# Altium project Controller.PrjPcb
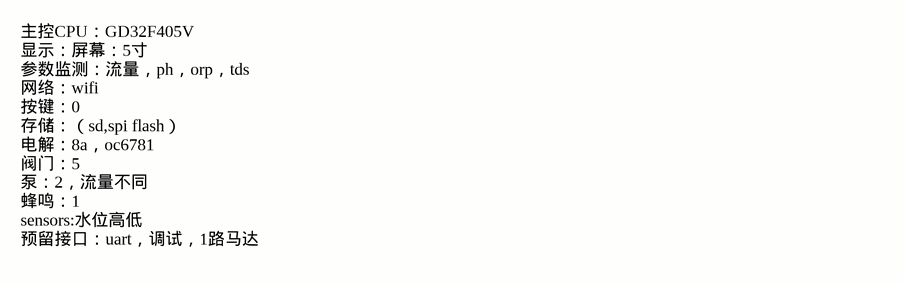
[diagram p0: top.SchDoc]
7 sheets, 134 parts. Net scope: global (net labels, ports and power ports of the same name join across sheets).
Board file: 电解模块主控板_V1.0_ZM_20210726.PcbDoc
Sheets:
  top.SchDoc
  cpu.SchDoc
  04_Sensor.SchDoc
  02_Power.SchDoc
  com.SchDoc
  15_LCD.SchDoc
  07_EL_CON.SchDoc

## Sheet top.SchDoc
size A4

### Notes on the sheet
- 主控CPU：GD32F405V
  显示：屏幕：5寸
  参数监测：流量，ph，orp，tds
  网络：wifi
  按键：0
  存储：（sd,spi flash）
  电解：8a，oc6781
  阀门：5
  泵：2，流量不同
  蜂鸣：1
  sensors:水位高低
  预留接口：uart，调试，1路马达

## Sheet cpu.SchDoc
size A2
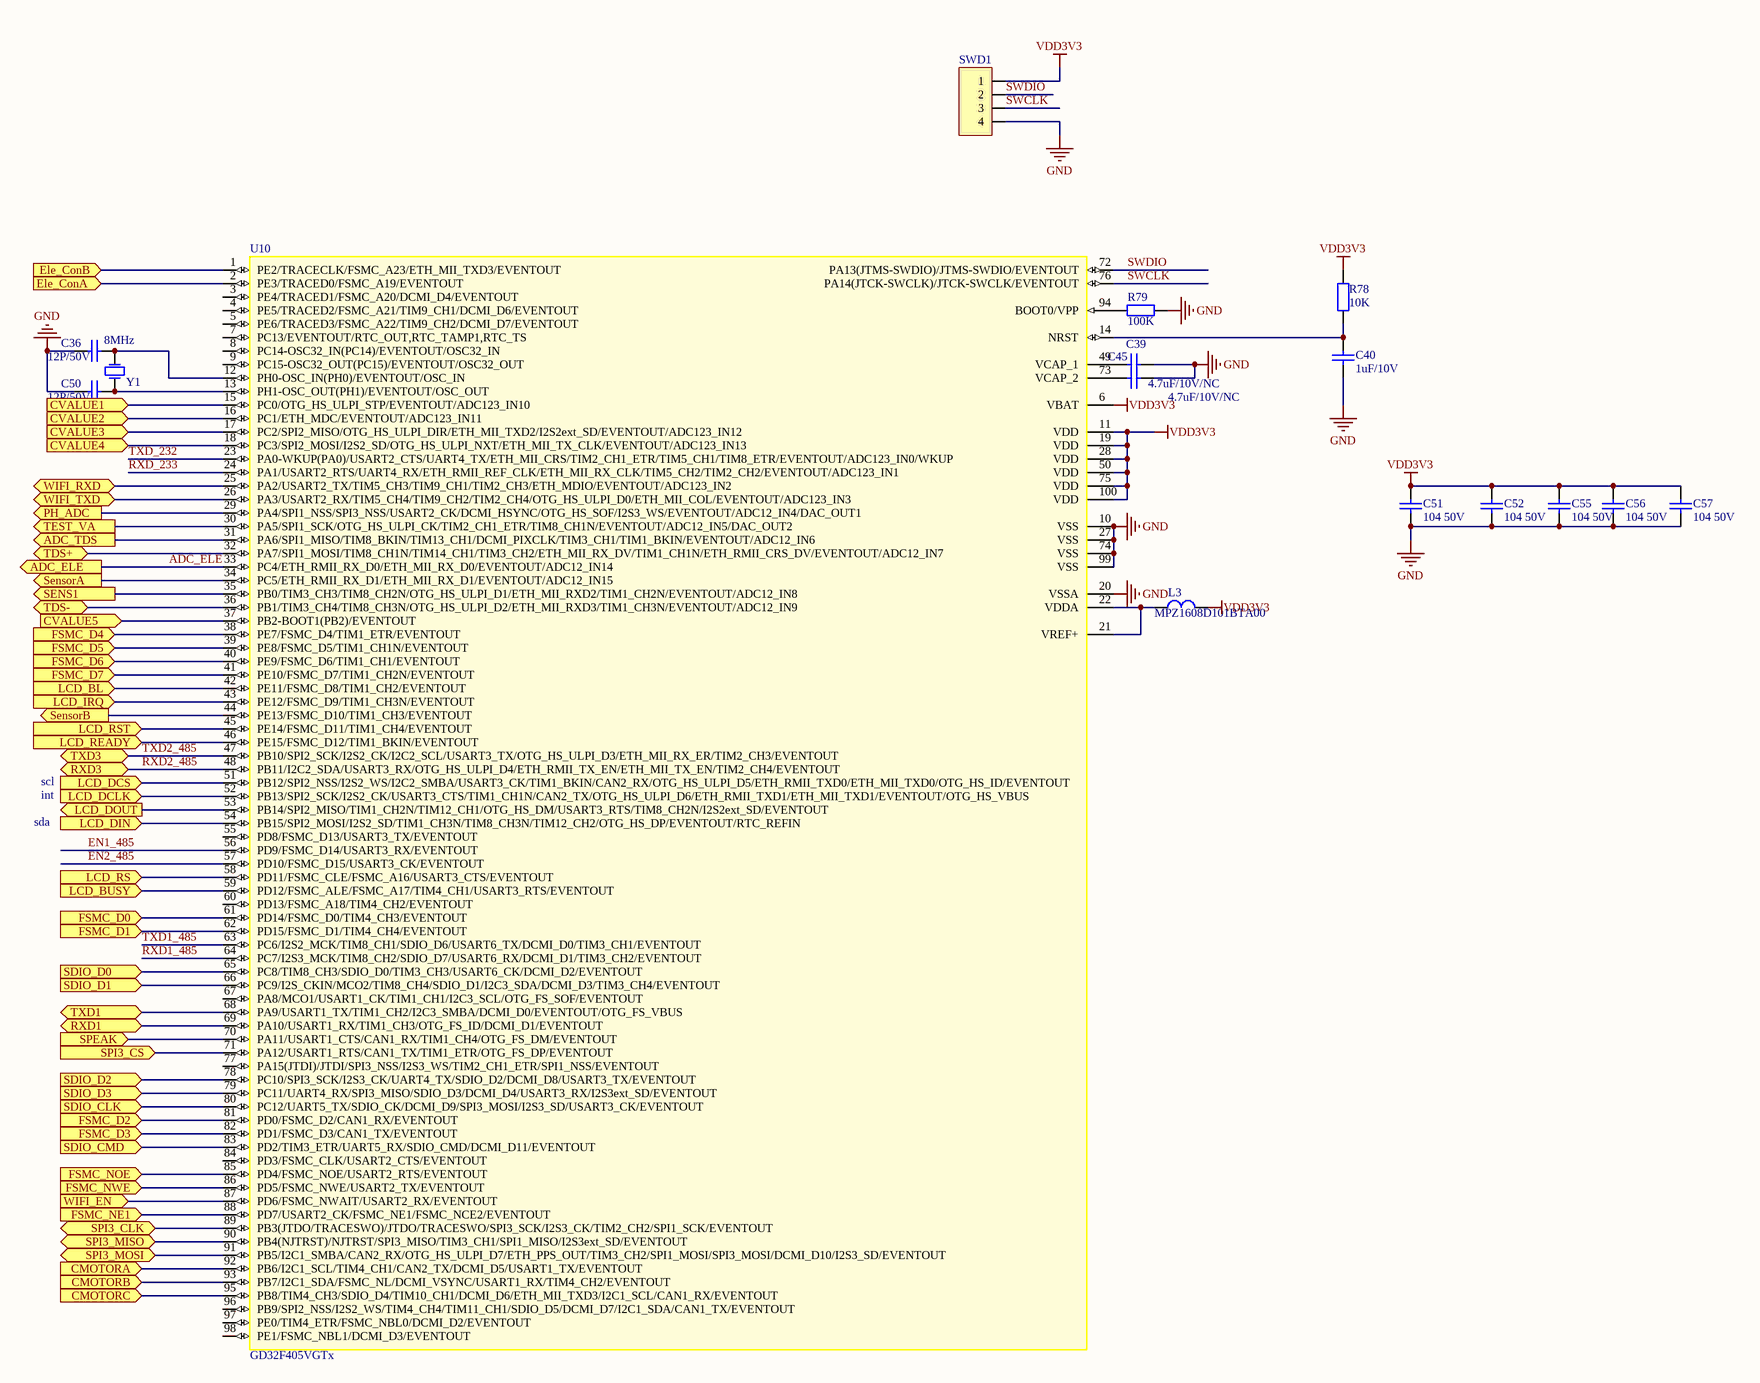
[diagram p1: cpu.SchDoc]

### Parts
C36  12P/50V  [SMD-0603C]
C39  4.7uF/10V/NC  [SMD-0603C]
C40  1uF/10V  [SMD-0603C]
C45  4.7uF/10V/NC  [SMD-0603C]
C50  12P/50V  [SMD-0603C]
C51  104 50V  [SMD-0603C]
C52  104 50V  [SMD-0603C]
C55  104 50V  [SMD-0603C]
C56  104 50V  [SMD-0603C]
C57  104 50V  [SMD-0603C]
L3  MPZ1608D101BTA00  [SMD-0603]
R78  10K  [SMD-0603]
R79  100K  [SMD-0603]
SWD1  SIP-4 (NC)  [SIP-4]  (value not drawn)
U10  GD32F405VGTx  [STM-LQFP100_N]
Y1  8MHz  [XTAL-3225-2]

### Ports
ADC_ELE (out), ADC_TDS (out), CMOTORA (in), CMOTORB (in), CMOTORC (in), CVALUE1 (in), CVALUE2 (in), CVALUE3 (in), CVALUE4 (in), CVALUE5 (in), Ele_ConA (in), Ele_ConB (in), FSMC_D0 (in), FSMC_D1 (in), FSMC_D2 (in), FSMC_D3 (in), FSMC_D4 (in), FSMC_D5 (in), FSMC_D6 (in), FSMC_D7 (in), FSMC_NE1 (in), FSMC_NOE (in), FSMC_NWE (in), LCD_BL (in), LCD_BUSY (in), LCD_DCLK (in), LCD_DCS (in), LCD_DIN (in), LCD_DOUT (out), LCD_IRQ (in), LCD_READY (in), LCD_RS (in), LCD_RST (in), PH_ADC (out), RXD1 (bidir), RXD3 (bidir), SDIO_CLK (in), SDIO_CMD (in), SDIO_D0 (in), SDIO_D1 (in), SDIO_D2 (in), SDIO_D3 (in), SENS1 (out), SensorA (out), SensorB (out), SPEAK (in), SPI3_CLK (bidir), SPI3_CS (in), SPI3_MISO (bidir), SPI3_MOSI (bidir), TDS+ (bidir), TDS- (bidir), TEST_VA (out), TXD1 (bidir), TXD3 (bidir), WIFI_EN (in), WIFI_RXD (bidir), WIFI_TXD (bidir)

### Nets
GND: C36.2 C39.1 C40.1 C45.1 C50.2 C51.1 C52.1 C55.1 C56.1 C57.1 R79.1 SWD1.4 U10.10(VSS) U10.20(VSSA) U10.27(VSS) U10.74(VSS) U10.99(VSS)
VDD3V3: C51.2 C52.2 C55.2 C56.2 C57.2 L3.1 R78.2 SWD1.1 U10.6(VBAT) U10.11(VDD) U10.19(VDD) U10.28(VDD) U10.50(VDD) U10.75(VDD) U10.100(VDD)  [project net 3.3V]
ADC_ELE: U10.33(PC4/ETH_RMII_RX_D0/ETH_MII_RX_D0/EVENTOUT/ADC12_IN14) ; port ADC_ELE
EN1_485: U10.56(PD9/FSMC_D14/USART3_RX/EVENTOUT)
EN2_485: U10.57(PD10/FSMC_D15/USART3_CK/EVENTOUT)
RXD1_485: U10.64(PC7/I2S3_MCK/TIM8_CH2/SDIO_D7/USART6_RX/DCMI_D1/TIM3_CH2/EVENTOUT)
RXD2_485: U10.48(PB11/I2C2_SDA/USART3_RX/OTG_HS_ULPI_D4/ETH_RMII_TX_EN/ETH_MII_TX_EN/TIM2_CH4/EVENTOUT) ; port RXD3
RXD_233: U10.24(PA1/USART2_RTS/UART4_RX/ETH_RMII_REF_CLK/ETH_MII_RX_CLK/TIM5_CH2/TIM2_CH2/EVENTOUT/ADC123_IN1)
SWCLK: SWD1.3 U10.76(PA14(JTCK-SWCLK)/JTCK-SWCLK/EVENTOUT)
SWDIO: SWD1.2 U10.72(PA13(JTMS-SWDIO)/JTMS-SWDIO/EVENTOUT)
TXD1_485: U10.63(PC6/I2S2_MCK/TIM8_CH1/SDIO_D6/USART6_TX/DCMI_D0/TIM3_CH1/EVENTOUT)
TXD2_485: U10.47(PB10/SPI2_SCK/I2S2_CK/I2C2_SCL/USART3_TX/OTG_HS_ULPI_D3/ETH_MII_RX_ER/TIM2_CH3/EVENTOUT) ; port TXD3
TXD_232: U10.23(PA0-WKUP(PA0)/USART2_CTS/UART4_TX/ETH_MII_CRS/TIM2_CH1_ETR/TIM5_CH1/TIM8_ETR/EVENTOUT/ADC123_IN0/WKUP)
NetC12_2: U10.31(PA6/SPI1_MISO/TIM8_BKIN/TIM13_CH1/DCMI_PIXCLK/TIM3_CH1/TIM1_BKIN/EVENTOUT/ADC12_IN6) ; port ADC_TDS
NetC36_1: C36.1 U10.12(PH0-OSC_IN(PH0)/EVENTOUT/OSC_IN) Y1.2(OSC2)
NetC37_2: U10.44(PE13/FSMC_D10/TIM1_CH3/EVENTOUT) ; port SensorB
NetC38_2: U10.34(PC5/ETH_RMII_RX_D1/ETH_MII_RX_D1/EVENTOUT/ADC12_IN15) ; port SensorA
NetC39_2: C39.2 U10.49(VCAP_1)
NetC40_2: C40.2 R78.1 U10.14(NRST)
NetC45_2: C45.2 U10.73(VCAP_2)
NetC50_1: C50.1 U10.13(PH1-OSC_OUT(PH1)/EVENTOUT/OSC_OUT) Y1.1(OSC1)
NetL3_2: L3.2 U10.21(VREF+) U10.22(VDDA)
NetP1_1: U10.36(PB1/TIM3_CH4/TIM8_CH3N/OTG_HS_ULPI_D2/ETH_MII_RXD3/TIM1_CH3N/EVENTOUT/ADC12_IN9) ; port TDS-
NetP16_3: U10.61(PD14/FSMC_D0/TIM4_CH3/EVENTOUT) ; port FSMC_D0
NetP16_4: U10.62(PD15/FSMC_D1/TIM4_CH4/EVENTOUT) ; port FSMC_D1
NetP16_5: U10.81(PD0/FSMC_D2/CAN1_RX/EVENTOUT) ; port FSMC_D2
NetP16_6: U10.82(PD1/FSMC_D3/CAN1_TX/EVENTOUT) ; port FSMC_D3
NetP16_7: U10.38(PE7/FSMC_D4/TIM1_ETR/EVENTOUT) ; port FSMC_D4
NetP16_8: U10.39(PE8/FSMC_D5/TIM1_CH1N/EVENTOUT) ; port FSMC_D5
NetP16_9: U10.40(PE9/FSMC_D6/TIM1_CH1/EVENTOUT) ; port FSMC_D6
NetP16_10: U10.41(PE10/FSMC_D7/TIM1_CH2N/EVENTOUT) ; port FSMC_D7
NetP16_11: U10.86(PD5/FSMC_NWE/USART2_TX/EVENTOUT) ; port FSMC_NWE
NetP16_12: U10.88(PD7/USART2_CK/FSMC_NE1/FSMC_NCE2/EVENTOUT) ; port FSMC_NE1
NetP16_13: U10.58(PD11/FSMC_CLE/FSMC_A16/USART3_CTS/EVENTOUT) ; port LCD_RS
NetP16_14: U10.85(PD4/FSMC_NOE/USART2_RTS/EVENTOUT) ; port FSMC_NOE
NetP16_15: U10.46(PE15/FSMC_D12/TIM1_BKIN/EVENTOUT) ; port LCD_READY
NetP16_16: U10.42(PE11/FSMC_D8/TIM1_CH2/EVENTOUT) ; port LCD_BL
NetP16_17: U10.43(PE12/FSMC_D9/TIM1_CH3N/EVENTOUT) ; port LCD_IRQ
NetP16_18: U10.59(PD12/FSMC_ALE/FSMC_A17/TIM4_CH1/USART3_RTS/EVENTOUT) ; port LCD_BUSY
NetP16_21: U10.52(PB13/SPI2_SCK/I2S2_CK/USART3_CTS/TIM1_CH1N/CAN2_TX/OTG_HS_ULPI_D6/ETH_RMII_TXD1/ETH_MII_TXD1/EVENTOUT/OTG_HS_VBUS) ; port LCD_DCLK
NetP16_22: U10.51(PB12/SPI2_NSS/I2S2_WS/I2C2_SMBA/USART3_CK/TIM1_BKIN/CAN2_RX/OTG_HS_ULPI_D5/ETH_RMII_TXD0/ETH_MII_TXD0/OTG_HS_ID/EVENTOUT) ; port LCD_DCS
NetP16_23: U10.54(PB15/SPI2_MOSI/I2S2_SD/TIM1_CH3N/TIM8_CH3N/TIM12_CH2/OTG_HS_DP/EVENTOUT/RTC_REFIN) ; port LCD_DIN
NetP16_24: U10.53(PB14/SPI2_MISO/TIM1_CH2N/TIM12_CH1/OTG_HS_DM/USART3_RTS/TIM8_CH2N/I2S2ext_SD/EVENTOUT) ; port LCD_DOUT
NetP20_6: U10.45(PE14/FSMC_D11/TIM1_CH4/EVENTOUT) ; port LCD_RST
NetR14_1: U10.32(PA7/SPI1_MOSI/TIM8_CH1N/TIM14_CH1/TIM3_CH2/ETH_MII_RX_DV/TIM1_CH1N/ETH_RMII_CRS_DV/EVENTOUT/ADC12_IN7) ; port TDS+
NetR19_2: U10.35(PB0/TIM3_CH3/TIM8_CH2N/OTG_HS_ULPI_D1/ETH_MII_RXD2/TIM1_CH2N/EVENTOUT/ADC12_IN8) ; port SENS1
NetR20_1: U10.2(PE3/TRACED0/FSMC_A19/EVENTOUT) ; port Ele_ConA
NetR27_1: U10.1(PE2/TRACECLK/FSMC_A23/ETH_MII_TXD3/EVENTOUT) ; port Ele_ConB
NetR79_2: R79.2 U10.94(BOOT0/VPP)
NetU10_15: U10.15(PC0/OTG_HS_ULPI_STP/EVENTOUT/ADC123_IN10) ; port CVALUE1
NetU10_16: U10.16(PC1/ETH_MDC/EVENTOUT/ADC123_IN11) ; port CVALUE2
NetU10_17: U10.17(PC2/SPI2_MISO/OTG_HS_ULPI_DIR/ETH_MII_TXD2/I2S2ext_SD/EVENTOUT/ADC123_IN12) ; port CVALUE3
NetU10_18: U10.18(PC3/SPI2_MOSI/I2S2_SD/OTG_HS_ULPI_NXT/ETH_MII_TX_CLK/EVENTOUT/ADC123_IN13) ; port CVALUE4
NetU10_25: U10.25(PA2/USART2_TX/TIM5_CH3/TIM9_CH1/TIM2_CH3/ETH_MDIO/EVENTOUT/ADC123_IN2) ; port WIFI_RXD
NetU10_26: U10.26(PA3/USART2_RX/TIM5_CH4/TIM9_CH2/TIM2_CH4/OTG_HS_ULPI_D0/ETH_MII_COL/EVENTOUT/ADC123_IN3) ; port WIFI_TXD
NetU10_29: U10.29(PA4/SPI1_NSS/SPI3_NSS/USART2_CK/DCMI_HSYNC/OTG_HS_SOF/I2S3_WS/EVENTOUT/ADC12_IN4/DAC_OUT1) ; port PH_ADC
NetU10_30: U10.30(PA5/SPI1_SCK/OTG_HS_ULPI_CK/TIM2_CH1_ETR/TIM8_CH1N/EVENTOUT/ADC12_IN5/DAC_OUT2) ; port TEST_VA
NetU10_37: U10.37(PB2-BOOT1(PB2)/EVENTOUT) ; port CVALUE5
NetU10_65: U10.65(PC8/TIM8_CH3/SDIO_D0/TIM3_CH3/USART6_CK/DCMI_D2/EVENTOUT) ; port SDIO_D0
NetU10_66: U10.66(PC9/I2S_CKIN/MCO2/TIM8_CH4/SDIO_D1/I2C3_SDA/DCMI_D3/TIM3_CH4/EVENTOUT) ; port SDIO_D1
NetU10_68: U10.68(PA9/USART1_TX/TIM1_CH2/I2C3_SMBA/DCMI_D0/EVENTOUT/OTG_FS_VBUS) ; port TXD1
NetU10_69: U10.69(PA10/USART1_RX/TIM1_CH3/OTG_FS_ID/DCMI_D1/EVENTOUT) ; port RXD1
NetU10_70: U10.70(PA11/USART1_CTS/CAN1_RX/TIM1_CH4/OTG_FS_DM/EVENTOUT) ; port SPEAK
NetU10_71: U10.71(PA12/USART1_RTS/CAN1_TX/TIM1_ETR/OTG_FS_DP/EVENTOUT) ; port SPI3_CS
NetU10_78: U10.78(PC10/SPI3_SCK/I2S3_CK/UART4_TX/SDIO_D2/DCMI_D8/USART3_TX/EVENTOUT) ; port SDIO_D2
NetU10_79: U10.79(PC11/UART4_RX/SPI3_MISO/SDIO_D3/DCMI_D4/USART3_RX/I2S3ext_SD/EVENTOUT) ; port SDIO_D3
NetU10_80: U10.80(PC12/UART5_TX/SDIO_CK/DCMI_D9/SPI3_MOSI/I2S3_SD/USART3_CK/EVENTOUT) ; port SDIO_CLK
NetU10_83: U10.83(PD2/TIM3_ETR/UART5_RX/SDIO_CMD/DCMI_D11/EVENTOUT) ; port SDIO_CMD
NetU10_87: U10.87(PD6/FSMC_NWAIT/USART2_RX/EVENTOUT) ; port WIFI_EN
NetU10_89: U10.89(PB3(JTDO/TRACESWO)/JTDO/TRACESWO/SPI3_SCK/I2S3_CK/TIM2_CH2/SPI1_SCK/EVENTOUT) ; port SPI3_CLK
NetU10_90: U10.90(PB4(NJTRST)/NJTRST/SPI3_MISO/TIM3_CH1/SPI1_MISO/I2S3ext_SD/EVENTOUT) ; port SPI3_MISO
NetU10_91: U10.91(PB5/I2C1_SMBA/CAN2_RX/OTG_HS_ULPI_D7/ETH_PPS_OUT/TIM3_CH2/SPI1_MOSI/SPI3_MOSI/DCMI_D10/I2S3_SD/EVENTOUT) ; port SPI3_MOSI
NetU10_92: U10.92(PB6/I2C1_SCL/TIM4_CH1/CAN2_TX/DCMI_D5/USART1_TX/EVENTOUT) ; port CMOTORA
NetU10_93: U10.93(PB7/I2C1_SDA/FSMC_NL/DCMI_VSYNC/USART1_RX/TIM4_CH2/EVENTOUT) ; port CMOTORB
NetU10_95: U10.95(PB8/TIM4_CH3/SDIO_D4/TIM10_CH1/DCMI_D6/ETH_MII_TXD3/I2C1_SCL/CAN1_RX/EVENTOUT) ; port CMOTORC

Not connected (* = marked no-connect by the designer): U10 3(PE4/TRACED1/FSMC_A20/DCMI_D4/EVENTOUT) 4(PE5/TRACED2/FSMC_A21/TIM9_CH1/DCMI_D6/EVENTOUT) 5(PE6/TRACED3/FSMC_A22/TIM9_CH2/DCMI_D7/EVENTOUT) 7(PC13/EVENTOUT/RTC_OUT,RTC_TAMP1,RTC_TS) 8(PC14-OSC32_IN(PC14)/EVENTOUT/OSC32_IN) 9(PC15-OSC32_OUT(PC15)/EVENTOUT/OSC32_OUT) 55(PD8/FSMC_D13/USART3_TX/EVENTOUT) 60(PD13/FSMC_A18/TIM4_CH2/EVENTOUT) 67(PA8/MCO1/USART1_CK/TIM1_CH1/I2C3_SCL/OTG_FS_SOF/EVENTOUT) 77(PA15(JTDI)/JTDI/SPI3_NSS/I2S3_WS/TIM2_CH1_ETR/SPI1_NSS/EVENTOUT) 84(PD3/FSMC_CLK/USART2_CTS/EVENTOUT) 96(PB9/SPI2_NSS/I2S2_WS/TIM4_CH4/TIM11_CH1/SDIO_D5/DCMI_D7/I2C1_SDA/CAN1_TX/EVENTOUT) 97(PE0/TIM4_ETR/FSMC_NBL0/DCMI_D2/EVENTOUT) 98(PE1/FSMC_NBL1/DCMI_D3/EVENTOUT)

### Notes on the sheet
- scl
- int
- sda

### Library data of the parts
C36 C50 = CAP4: 贴片电容 5%
C39 C40 C45 C51 C52 C55-C57 = CAP4: 贴片电容 20%
L3 = CIZHU1: 磁珠电感 100R 100MHz
R78 R79 = RES2: 贴片电阻 5%
SWD1 = SIP-4: ISP 下载
U10 = STM32F405VGTx: Manufacturer: STMicroelectronics; PartNumber: STM32F405VGT6; Core: ARM Cortex-M4; D/A Converter: 2x12-bit; FLASH Size (Prog) (kB): 1024; I/Os (High Current): 82; Internal RAM Size (kB): 192; Operating Frequency(F) (Processor speed) (MHz): 168; Packing: Tray; Supply Voltage(Vcc) max (V): 3.6; Supply Voltage(Vcc) min (V): 1.8; DatasheetVersion: Rev. 4; PackageVersion: Rev. 1, 06/2013; PackageReference: LQFP100; PackageDescription: 100-Pin Low Profile Quad Flat Package, 14 x 14 mm Body, 0.5 mm Pitch; Mounting Technology: Surface Mount; ComponentLink1Description: Manufacturer URL; ComponentLink1URL: http://www.st.com/web/en/home.html; ComponentLink2Description: Datasheet; ComponentLink2URL: http://www.st.com/st-web-ui/static/active/en/resource/technical/document/datasheet/DM00037051.pdf; ComponentLink3Description: Package Specification; ComponentLink3URL: http://www.st.com/st-web-ui/static/active/en/resource/technical/document/data_brief/DM00071938.pdf
Y1 = XTAL: 3225 贴片晶振

## Sheet 04_Sensor.SchDoc
size A4
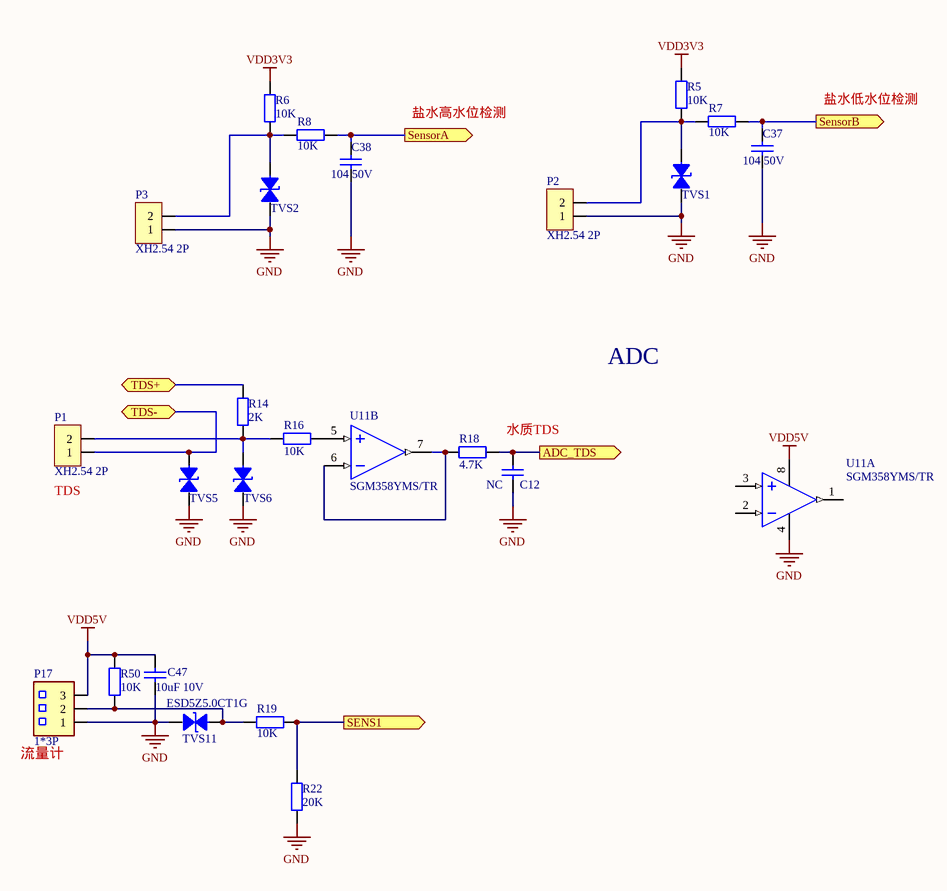
[diagram p2: 04_Sensor.SchDoc]

### Parts
C12  NC  [SMD-0603C]
C37  104 50V  [SMD-0603C]
C38  104 50V  [SMD-0603C]
C47  10uF 10V  [SMD-0603C]
P1  XH2.54 2P  [SIP-2A]
P2  XH2.54 2P  [SIP-2A]
P3  XH2.54 2P  [SIP-2A]
P17  1*3P  [3X2.54MMZ2]
R5  10K  [SMD-0603]
R6  10K  [SMD-0603]
R7  10K  [SMD-0603]
R8  10K  [SMD-0603]
R14  2K  [SMD-0603]
R16  10K  [SMD-0603]
R18  4.7K  [SMD-0603]
R19  10K  [SMD-0603]
R22  20K  [SMD-0603]
R50  10K  [SMD-0603]
TVS1  ESD5Z5.0CT1G  [SOD-523]  (value not drawn)
TVS2  ESD5Z5.0CT1G  [SOD-523]  (value not drawn)
TVS5  ESD5Z5.0CT1G  [SOD-523]  (value not drawn)
TVS6  ESD5Z5.0CT1G  [SOD-523]  (value not drawn)
TVS11  ESD5Z5.0CT1G  [SOD-523]
U11  SGM358YMS/TR  [MSOP-8]  (parts A,B of 2)

### Ports
ADC_TDS (out), SENS1 (out), SensorA (out), SensorB (out), TDS+ (bidir), TDS- (bidir)

### Nets
GND: C12.1 C37.1 C38.1 C47.1 P2.1 P3.1 P17.1 R22.1 TVS1.1(A) TVS2.1(A) TVS5.1(A) TVS6.1(A) TVS11.1(A) U11.4(V-)
VDD3V3: R5.1 R6.1  [project net 3.3V]
VDD5V: C47.2 P17.3 R50.1 U11.8(V+)
NetC12_2: C12.2 R18.1 ; port ADC_TDS
NetC37_2: C37.2 R7.2 ; port SensorB
NetC38_2: C38.2 R8.2 ; port SensorA
NetP1_1: P1.1 TVS5.2(B) ; port TDS-
NetP1_2: P1.2 R14.2 R16.1 TVS6.2(B)
NetP2_2: P2.2 R5.2 R7.1 TVS1.2(B)
NetP3_2: P3.2 R6.2 R8.1 TVS2.2(B)
NetP17_2: P17.2 R19.1 R50.2 TVS11.2(B)
NetR14_1: R14.1 ; port TDS+
NetR16_2: R16.2 U11.5(IN2+)
NetR18_2: R18.2 U11.6(IN2-) U11.7(OUT2)
NetR19_2: R19.2 R22.2 ; port SENS1

Not connected (* = marked no-connect by the designer): U11 1(OUT1) 2(IN1-) 3(IN1+)

### Notes on the sheet
- 盐水高水位检测
- 盐水低水位检测
- ADC
- 水质TDS
- (near P1) TDS
- (near P17) 流量计

### Library data of the parts
C12 = CAP4: 贴片电容 10%
C37 C38 = CAP4: 贴片电容 20%
C47 = 0805 22uF (226) 20% 25V: 贴片电容 10%; value: 22uF 10V X5R; ComponentLink1Description: 供应商链接; ComponentLink1URL: http://www.szlcsc.com/product/details_46786.html; Package: 0805; Supplier: LC; SuppliersPartNumber: C45783
P1-P3 = SIP-2: XH2.54 2P 直插
P17 = HDR1*3
R5-R8 R14 R16 = RES0: 贴片电阻 1%
R18 = RES0: 贴片电阻 5%
R19 R22 R50 = 0603 10KΩ (1002) 1%: 贴片电阻 5%; ComponentLink1Description: 供应商链接; ComponentLink1URL: http://www.szlcsc.com/product/details_26547.html; Package: 0603; Supplier: LC; SuppliersPartNumber: C25804
TVS1 TVS2 TVS5 TVS6 = TVS-1: TVS
TVS11 = TVS-1: TVS 5.0V
U11 = LM358: 运放

## Sheet 02_Power.SchDoc
size A4
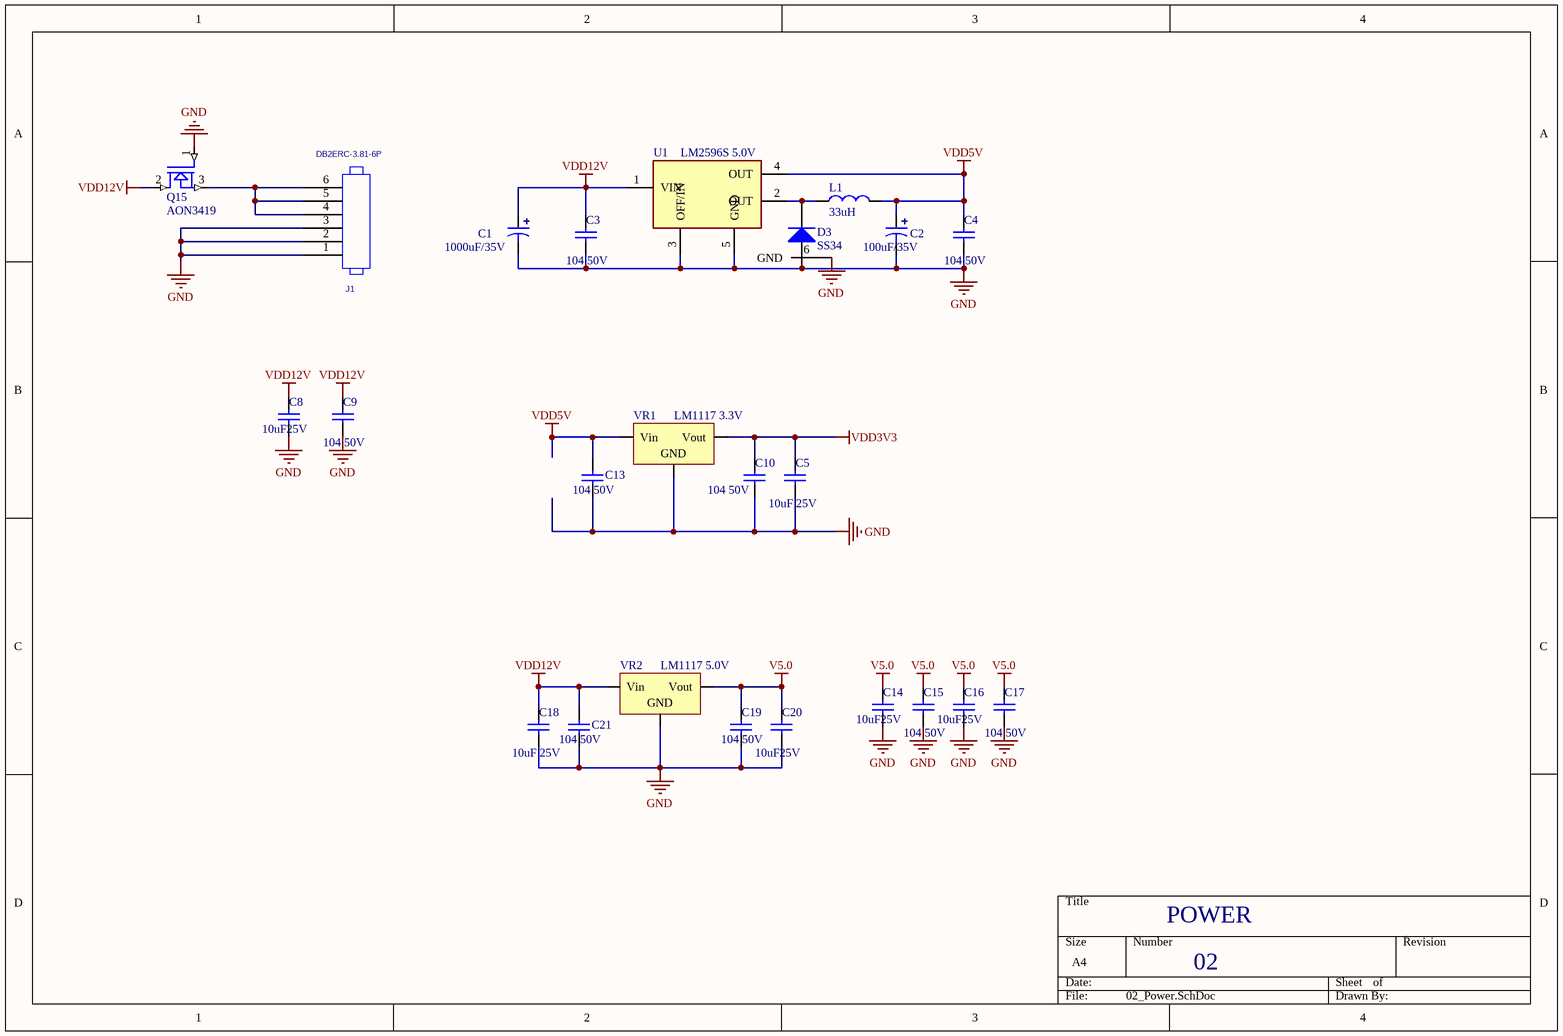
[diagram p3: 02_Power.SchDoc]

### Parts
C1  1000uF/35V  [10*16]
C2  100uF/35V  [6*8]
C3  104 50V  [SMD-0805C]
C4  104 50V  [SMD-0805C]
C5  10uF 25V  [SMD-0603C]
C8  10uF25V  [SMD-0603C]
C9  104 50V  [SMD-0603C]
C10  104 50V  [SMD-0603C]
C13  104 50V  [SMD-0603C]
C14  10uF25V  [SMD-0603C]
C15  104 50V  [SMD-0603C]
C16  10uF25V  [SMD-0603C]
C17  104 50V  [SMD-0603C]
C18  10uF 25V  [SMD-0603C]
C19  104 50V  [SMD-0603C]
C20  10uF25V  [SMD-0603C]
C21  104 50V  [SMD-0603C]
D3  SS34  [SMA]
J1  value DB2ERC-3.81-6P  [DB2ERC-3P81-6P]  (hidden comment: HEADER_6)
L1  33uH  [CDRH-127]
Q15  AON3419  [DFN3*3-8]
U1  LM2596S 5.0V  [TO-263-5]
VR1  LM1117 3.3V  [SOT223]
VR2  LM1117 5.0V  [SOT223]

### Nets
GND: C1.2 C2.2 C3.1 C4.1 C5.1 C8.1 C9.1 C10.1 C13.1 C14.1 C15.1 C16.1 C17.1 C18.1 C19.1 C20.1 C21.1 D3.1(A) J1.1 J1.2 J1.3 Q15.1(G) U1.3(OFF/IN) U1.5(GND) U1.6(GND) VR1.1(GND) VR2.1(GND)
V5.0: C14.2 C15.2 C16.2 C17.2 C19.2 C20.2 VR2.2(Vout)
VDD3V3: C5.2 C10.2 VR1.2(Vout)  [project net 3.3V]
VDD5V: C2.1 C4.2 C13.2 L1.2 U1.4(OUT) VR1.3(Vin)
VDD12V: C1.1 C3.2 C8.2 C9.2 C18.2 C21.2 Q15.2(D) U1.1(VIN) VR2.3(Vin)
NetD3_2: D3.2(K) L1.1 U1.2(OUT)
NetJ1_4: J1.4 J1.5 J1.6 Q15.3(S)

### Notes on the sheet
- POWER
- 02

### Library data of the parts
C1 C2 = CAP2: 电解电容
C3 C4 C8-C10 C13 = CAP4: 贴片电容 10%
C5 C14-C21 = CAP4: 贴片电容 20%
D3 = DIODE
J1 = HEADER_6: Source_Path: C:\MYPROGRAM\CADENCE\SPB_16.6\TOOLS\CAPTURE\LIBRARY\CONNECTOR.OLB; PCB DECAL: DB2ERC-3P81-6P
L1 = IND
Q15 = MOSFET N
U1 = LM2596
VR1 = LM1117: 三端稳压器
VR2 = LM1117: 三端稳压器 （耐压20V）

## Sheet com.SchDoc
size A4
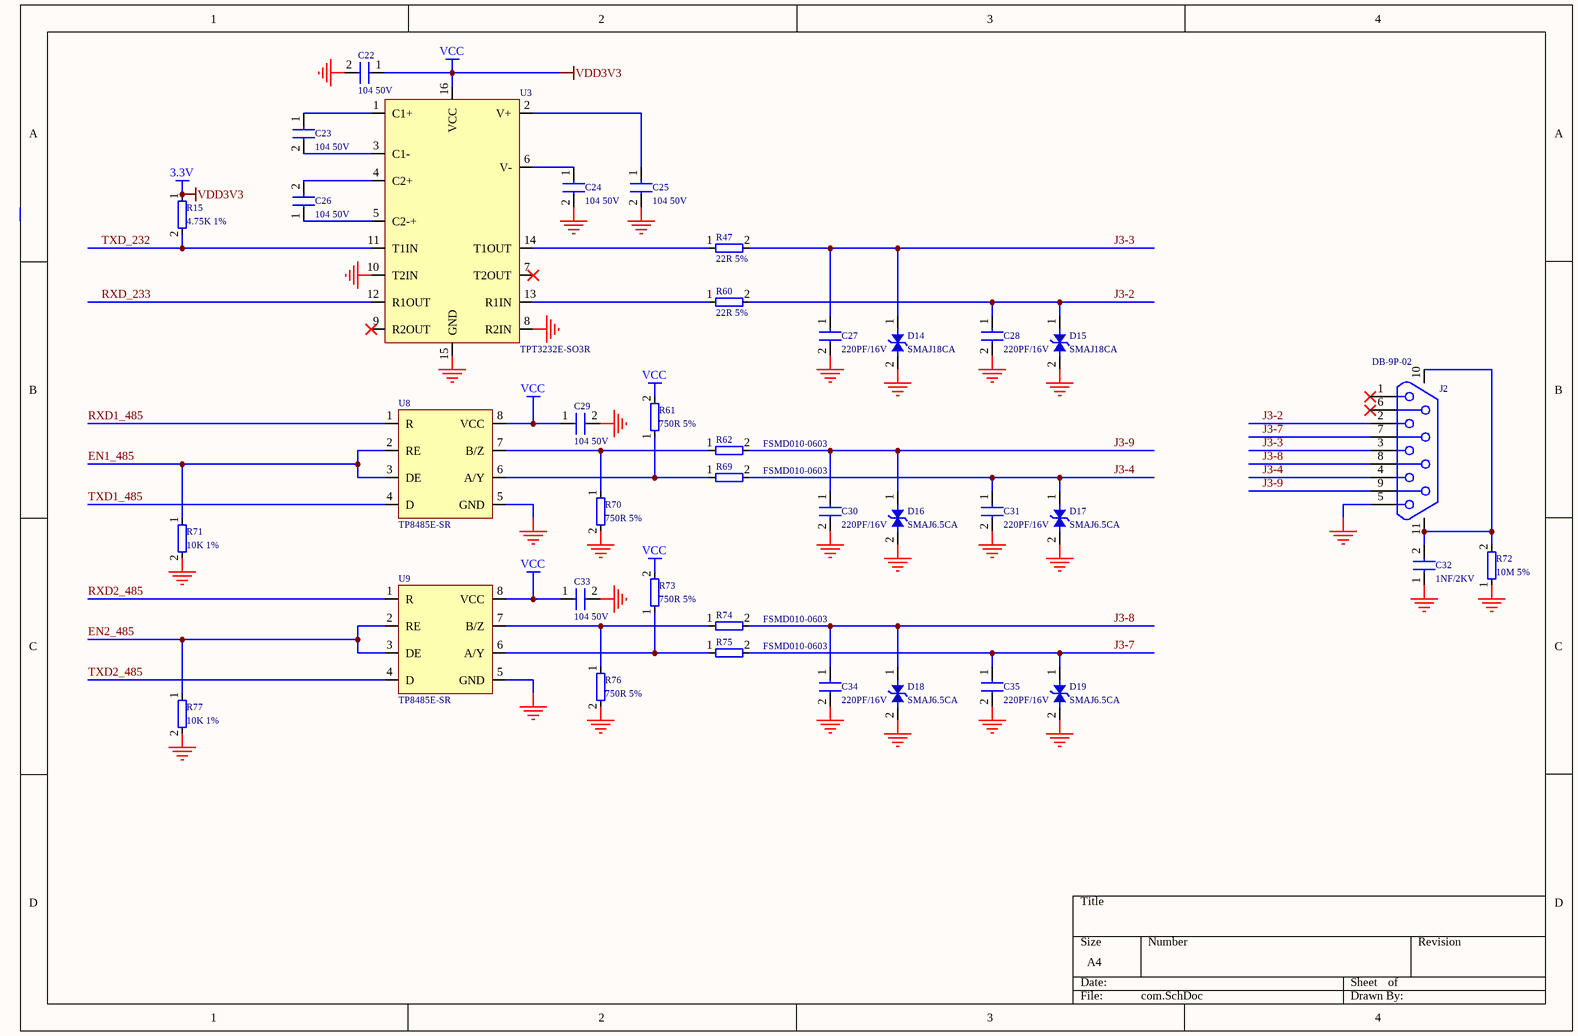
[diagram p4: com.SchDoc]

### Parts
C22  104 50V  [0603C]
C23  104 50V  [0603C]
C24  104 50V  [0603C]
C25  104 50V  [0603C]
C26  104 50V  [0603C]
C27  220PF/16V  [0603C]
C28  220PF/16V  [0603C]
C29  104 50V  [0603C]
C30  220PF/16V  [0603C]
C31  220PF/16V  [0603C]
C32  1NF/2KV  [1206C]
C33  104 50V  [0603C]
C34  220PF/16V  [0603C]
C35  220PF/16V  [0603C]
D14  SMAJ18CA  [SMA]
D15  SMAJ18CA  [SMA]
D16  SMAJ6.5CA  [SMA]
D17  SMAJ6.5CA  [SMA]
D18  SMAJ6.5CA  [SMA]
D19  SMAJ6.5CA  [SMA]
J2  DB-9P-02  [DIP-9]
R15  4.75K 1%  [0603R]
R47  22R 5%  [0603R]
R60  22R 5%  [0603R]
R61  750R 5%  [0603R]
R62  FSMD010-0603  [0603R]
R69  FSMD010-0603  [0603R]
R70  750R 5%  [0603R]
R71  10K 1%  [0603R]
R72  10M 5%  [1206r]
R73  750R 5%  [0603R]
R74  FSMD010-0603  [0603R]
R75  FSMD010-0603  [0603R]
R76  750R 5%  [0603R]
R77  10K 1%  [0603R]
U3  TPT3232E-SO3R  [SO-16Z]
U8  TP8485E-SR  [SO-8]
U9  TP8485E-SR  [SO-8]

### Nets
3.3V: C22.1 C29.1 C33.1 R15.1 R61.2 R73.2 U3.16(VCC) U8.8(VCC) U9.8(VCC)  [also labelled VCC, VDD3V3]
GND: C22.2 C24.2 C25.2 C27.2 C28.2 C29.2 C30.2 C31.2 C32.1 C33.2 C34.2 C35.2 D14.2 D15.2 D16.2 D17.2 D18.2 D19.2 J2.5 R70.2 R71.2 R72.1 R76.2 R77.2 U3.8(R2IN) U3.10(T2IN) U3.15(GND) U8.5(GND) U9.5(GND)
EN1_485: R71.1 U8.2(RE) U8.3(DE)
EN2_485: R77.1 U9.2(RE) U9.3(DE)
J3-2: C28.1 D15.1 J2.2 R60.2
J3-3: C27.1 D14.1 J2.3 R47.2
J3-4: C31.1 D17.1 J2.4 R69.2
J3-7: C35.1 D19.1 J2.7 R75.2
J3-8: C34.1 D18.1 J2.8 R74.2
J3-9: C30.1 D16.1 J2.9 R62.2
RXD1_485: U8.1(R)
RXD2_485: U9.1(R)
RXD_233: U3.12(R1OUT)
TXD1_485: U8.4(D)
TXD2_485: U9.4(D)
TXD_232: R15.2 U3.11(T1IN)
NetC23_1: C23.1 U3.1(C1+)
NetC23_2: C23.2 U3.3(C1-)
NetC24_1: C24.1 U3.6(V-)
NetC25_1: C25.1 U3.2(V+)
NetC26_1: C26.1 U3.5(C2-+)
NetC26_2: C26.2 U3.4(C2+)
NetC32_2: C32.2 J2.10 J2.11 R72.2
NetR47_1: R47.1 U3.14(T1OUT)
NetR60_1: R60.1 U3.13(R1IN)
NetR61_1: R61.1 R69.1 U8.6(A/Y)
NetR62_1: R62.1 R70.1 U8.7(B/Z)
NetR73_1: R73.1 R75.1 U9.6(A/Y)
NetR74_1: R74.1 R76.1 U9.7(B/Z)

Not connected (* = marked no-connect by the designer): J2 1* 6*; U3 7(T2OUT)* 9(R2OUT)*

### Library data of the parts
C22-C35 = CAP
D14-D19 = D_ESD
J2 = DB9
R15 R47 R60-R62 R69-R77 = RES

## Sheet 15_LCD.SchDoc
size A4
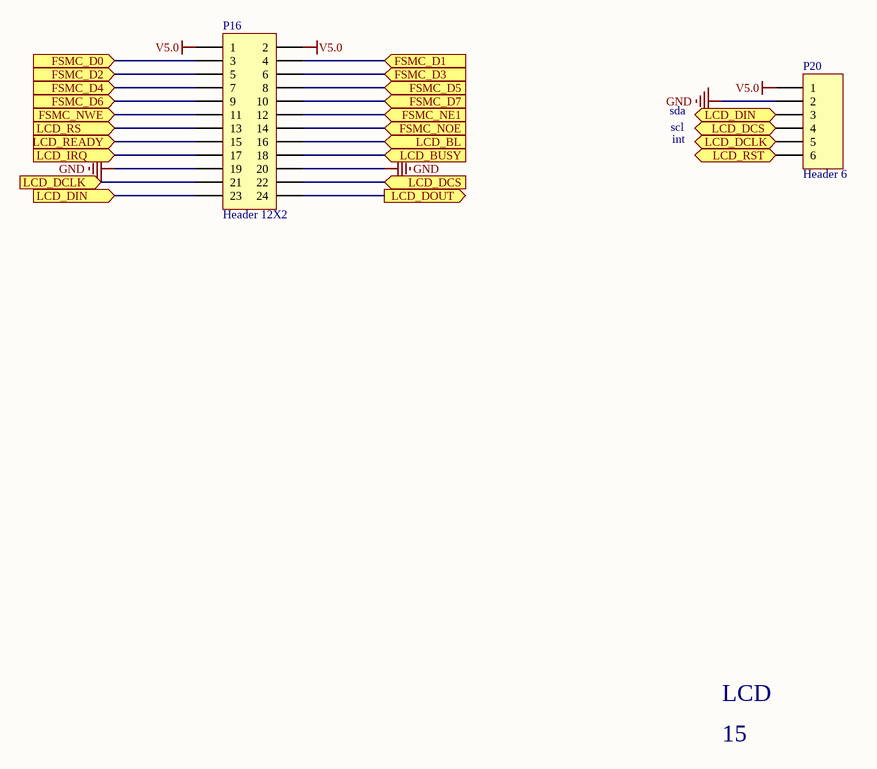
[diagram p5: 15_LCD.SchDoc]

### Parts
P16  Header 12X2  [HDR2X12]
P20  Header 6  [HDR1X6]

### Ports
FSMC_D0 (in), FSMC_D1 (in), FSMC_D2 (in), FSMC_D3 (in), FSMC_D4 (in), FSMC_D5 (in), FSMC_D6 (in), FSMC_D7 (in), FSMC_NE1 (in), FSMC_NOE (in), FSMC_NWE (in), LCD_BL (in), LCD_BUSY (in), LCD_DCLK (in), LCD_DCS (in), LCD_DIN (in), LCD_DOUT (out), LCD_IRQ (in), LCD_READY (in), LCD_RS (in), LCD_RST (in)

### Nets
GND: P16.19 P16.20 P20.2
V5.0: P16.1 P16.2 P20.1
NetP16_3: P16.3 ; port FSMC_D0
NetP16_4: P16.4 ; port FSMC_D1
NetP16_5: P16.5 ; port FSMC_D2
NetP16_6: P16.6 ; port FSMC_D3
NetP16_7: P16.7 ; port FSMC_D4
NetP16_8: P16.8 ; port FSMC_D5
NetP16_9: P16.9 ; port FSMC_D6
NetP16_10: P16.10 ; port FSMC_D7
NetP16_11: P16.11 ; port FSMC_NWE
NetP16_12: P16.12 ; port FSMC_NE1
NetP16_13: P16.13 ; port LCD_RS
NetP16_14: P16.14 ; port FSMC_NOE
NetP16_15: P16.15 ; port LCD_READY
NetP16_16: P16.16 ; port LCD_BL
NetP16_17: P16.17 ; port LCD_IRQ
NetP16_18: P16.18 ; port LCD_BUSY
NetP16_21: P16.21 P20.5 ; port LCD_DCLK
NetP16_22: P16.22 P20.4 ; port LCD_DCS
NetP16_23: P16.23 P20.3 ; port LCD_DIN
NetP16_24: P16.24 ; port LCD_DOUT
NetP20_6: P20.6 ; port LCD_RST

### Notes on the sheet
- sda
- scl
- int
- LCD
- 15

### Library data of the parts
P16 = Header 12X2: Header, 12-Pin, Dual row; LatestRevisionDate: 17-Jul-2002; LatestRevisionNote: Re-released for DXP Platform.; Publisher: Altium Limited
P20 = Header 6: Header, 6-Pin; LatestRevisionDate: 17-Jul-2002; LatestRevisionNote: Re-released for DXP Platform.; Publisher: Altium Limited

## Sheet 07_EL_CON.SchDoc
size A4
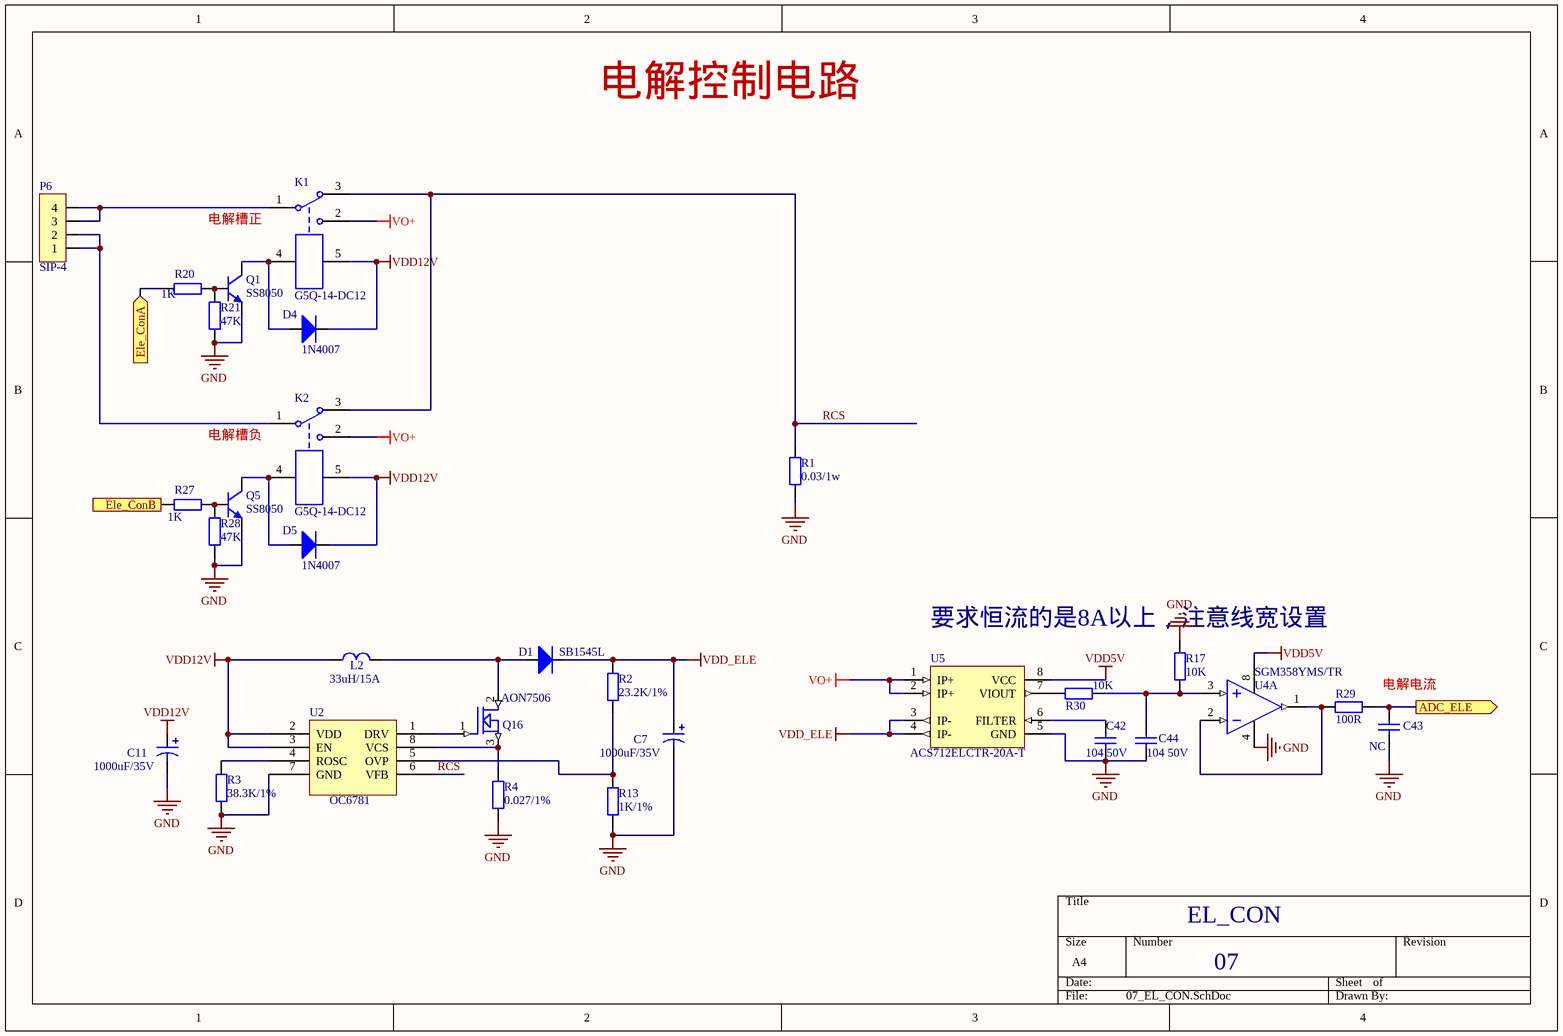
[diagram p6: 07_EL_CON.SchDoc]

### Parts
C7  1000uF/35V  [10*16]
C11  1000uF/35V  [10*16]
C42  104 50V  [SMD-0603C]
C43  NC  [SMD-0603C]
C44  104 50V  [SMD-0603C]
D1  SB1545L  [TO227]
D4  1N4007  [DO-214-AC]
D5  1N4007  [DO-214-AC]
K1  G5Q-14-DC12  [G5Q-14]
K2  G5Q-14-DC12  [G5Q-14]
L2  33uH/15A  [INDUCTOR_34*18]
P6  SIP-4  [VH-AW-3.96*4P]
Q1  SS8050  [SOT-23]
Q5  SS8050  [SOT-23]
Q16  AON7506  [DFN3*3-8]
R1  0.03/1w  [2512R]
R2  23.2K/1%  [SMD-0603]
R3  38.3K/1%  [SMD-0603]
R4  0.027/1%  [2512r]
R13  1K/1%  [SMD-0603]
R17  10K  [SMD-0603]
R20  1K  [SMD-0603]
R21  47K  [SMD-0603]
R27  1K  [SMD-0603]
R28  47K  [SMD-0603]
R29  100R  [SMD-0603]
R30  10K  [SMD-0603]
U2  OC6781  [SOP127P600X265_HS-9N]
U4  SGM358YMS/TR  [MSOP-8]  (part A of 2)
U5  ACS712ELCTR-20A-T  [SO-8]

### Ports
ADC_ELE (out), Ele_ConA (in), Ele_ConB (in)

### Nets
GND: C7.2 C11.2 C42.2 C43.1 C44.2 Q1.2(E) Q5.2(E) R1.2 R3.2 R4.2 R13.2 R17.1 R21.1 R28.1 U2.7(GND) U4.4(V-) U5.5(GND)
VDD5V: U4.8(V+) U5.8(VCC)
VDD12V: C11.1 D4.2(K) D5.2(K) K1.5 K2.5 L2.1 U2.2(VDD) U2.3(EN)
VDD_ELE: C7.1 D1.2(K) R2.1 U5.3(IP-) U5.4(IP-)
VO+: K1.2 K2.2 U5.1(IP+) U5.2(IP+)
ADC_ELE: C43.2 R29.1 ; port ADC_ELE
RCS: K1.3 K2.3 R1.1 U2.6(VFB)
NetC42_1: C42.1 U5.6(FILTER)
NetC44_1: C44.1 R17.2 R30.1 U4.3(IN1+)
NetD1_1: D1.1(A) L2.2 Q16.2(D)
NetD4_1: D4.1(A) K1.4 Q1.3(C)
NetD5_1: D5.1(A) K2.4 Q5.3(C)
NetK1_1: K1.1 P6.3 P6.4
NetK2_1: K2.1 P6.1 P6.2
NetQ1_1: Q1.1(B) R20.2 R21.2
NetQ5_1: Q5.1(B) R27.2 R28.2
NetQ16_1: Q16.1(G) U2.1(DRV)
NetQ16_3: Q16.3(S) R4.1 U2.8(VCS)
NetR2_2: R2.2 R13.1 U2.5(OVP)
NetR3_1: R3.1 U2.4(ROSC)
NetR20_1: R20.1 ; port Ele_ConA
NetR27_1: R27.1 ; port Ele_ConB
NetR29_2: R29.2 U4.1(OUT1) U4.2(IN1-)
NetR30_2: R30.2 U5.7(VIOUT)

### Notes on the sheet
- 电解控制电路
- 电解槽正
- 电解槽负
- 要求恒流的是8A以上，注意线宽设置
- 电解电流
- EL_CON
- 07

### Library data of the parts
C7 C11 = CAP2: 电解电容
C42 = C: 贴片电容 10%
C43 C44 = CAP4: 贴片电容 10%
D1 = DIODE2: 肖特基二极管
D4 D5 = DIODE2: 贴片二极管
K1 K2 = JDQ1: 5V 继电器
L2 = Inductor1: 10uH 1A
P6 = SIP-4: 3.96 4P 直插
Q1 Q5 = NPN-1: 三极管
Q16 = MOSFET N
R1-R4 R13 = R: 贴片电阻 5%
R17 R30 = RES0: 贴片电阻 1%
R20 R21 R27 R28 = RES2: 贴片电阻 5%
R29 = RES0: 贴片电阻 5%
U4 = LM358: 运算放大器
U5 = ACS712: HALL 20A 电流传感器

## Nets that join several sheets
3.3V: cpu (15 pins), 04_Sensor (R5.1 R6.1), 02_Power (C5.2 C10.2 VR1.2), com (9 pins)
GND: cpu (17 pins), 04_Sensor (14 pins), 02_Power (27 pins), com (29 pins), 15_LCD (P16.19 P16.20 P20.2), 07_EL_CON (17 pins)
V5.0: 02_Power (7 pins), 15_LCD (P16.1 P16.2 P20.1)
VDD5V: 04_Sensor (C47.2 P17.3 R50.1 U11.8), 02_Power (6 pins), 07_EL_CON (U4.8 U5.8)
VDD12V: 02_Power (9 pins), 07_EL_CON (8 pins)
ADC_ELE: cpu (U10.33), 07_EL_CON (C43.2 R29.1)
EN1_485: cpu (U10.56), com (R71.1 U8.2 U8.3)
EN2_485: cpu (U10.57), com (R77.1 U9.2 U9.3)
NetC12_2: cpu (U10.31), 04_Sensor (C12.2 R18.1)
NetC37_2: cpu (U10.44), 04_Sensor (C37.2 R7.2)
NetC38_2: cpu (U10.34), 04_Sensor (C38.2 R8.2)
NetP1_1: cpu (U10.36), 04_Sensor (P1.1 TVS5.2)
NetP16_3: cpu (U10.61), 15_LCD (P16.3)
NetP16_4: cpu (U10.62), 15_LCD (P16.4)
NetP16_5: cpu (U10.81), 15_LCD (P16.5)
NetP16_6: cpu (U10.82), 15_LCD (P16.6)
NetP16_7: cpu (U10.38), 15_LCD (P16.7)
NetP16_8: cpu (U10.39), 15_LCD (P16.8)
NetP16_9: cpu (U10.40), 15_LCD (P16.9)
NetP16_10: cpu (U10.41), 15_LCD (P16.10)
NetP16_11: cpu (U10.86), 15_LCD (P16.11)
NetP16_12: cpu (U10.88), 15_LCD (P16.12)
NetP16_13: cpu (U10.58), 15_LCD (P16.13)
NetP16_14: cpu (U10.85), 15_LCD (P16.14)
NetP16_15: cpu (U10.46), 15_LCD (P16.15)
NetP16_16: cpu (U10.42), 15_LCD (P16.16)
NetP16_17: cpu (U10.43), 15_LCD (P16.17)
NetP16_18: cpu (U10.59), 15_LCD (P16.18)
NetP16_21: cpu (U10.52), 15_LCD (P16.21 P20.5)
NetP16_22: cpu (U10.51), 15_LCD (P16.22 P20.4)
NetP16_23: cpu (U10.54), 15_LCD (P16.23 P20.3)
NetP16_24: cpu (U10.53), 15_LCD (P16.24)
NetP20_6: cpu (U10.45), 15_LCD (P20.6)
NetR14_1: cpu (U10.32), 04_Sensor (R14.1)
NetR19_2: cpu (U10.35), 04_Sensor (R19.2 R22.2)
NetR20_1: cpu (U10.2), 07_EL_CON (R20.1)
NetR27_1: cpu (U10.1), 07_EL_CON (R27.1)
RXD1_485: cpu (U10.64), com (U8.1)
RXD2_485: cpu (U10.48), com (U9.1)
RXD_233: cpu (U10.24), com (U3.12)
TXD1_485: cpu (U10.63), com (U8.4)
TXD2_485: cpu (U10.47), com (U9.4)
TXD_232: cpu (U10.23), com (R15.2 U3.11)